# Altium schematic sheet mainBoard_SCH.SchDoc
size C
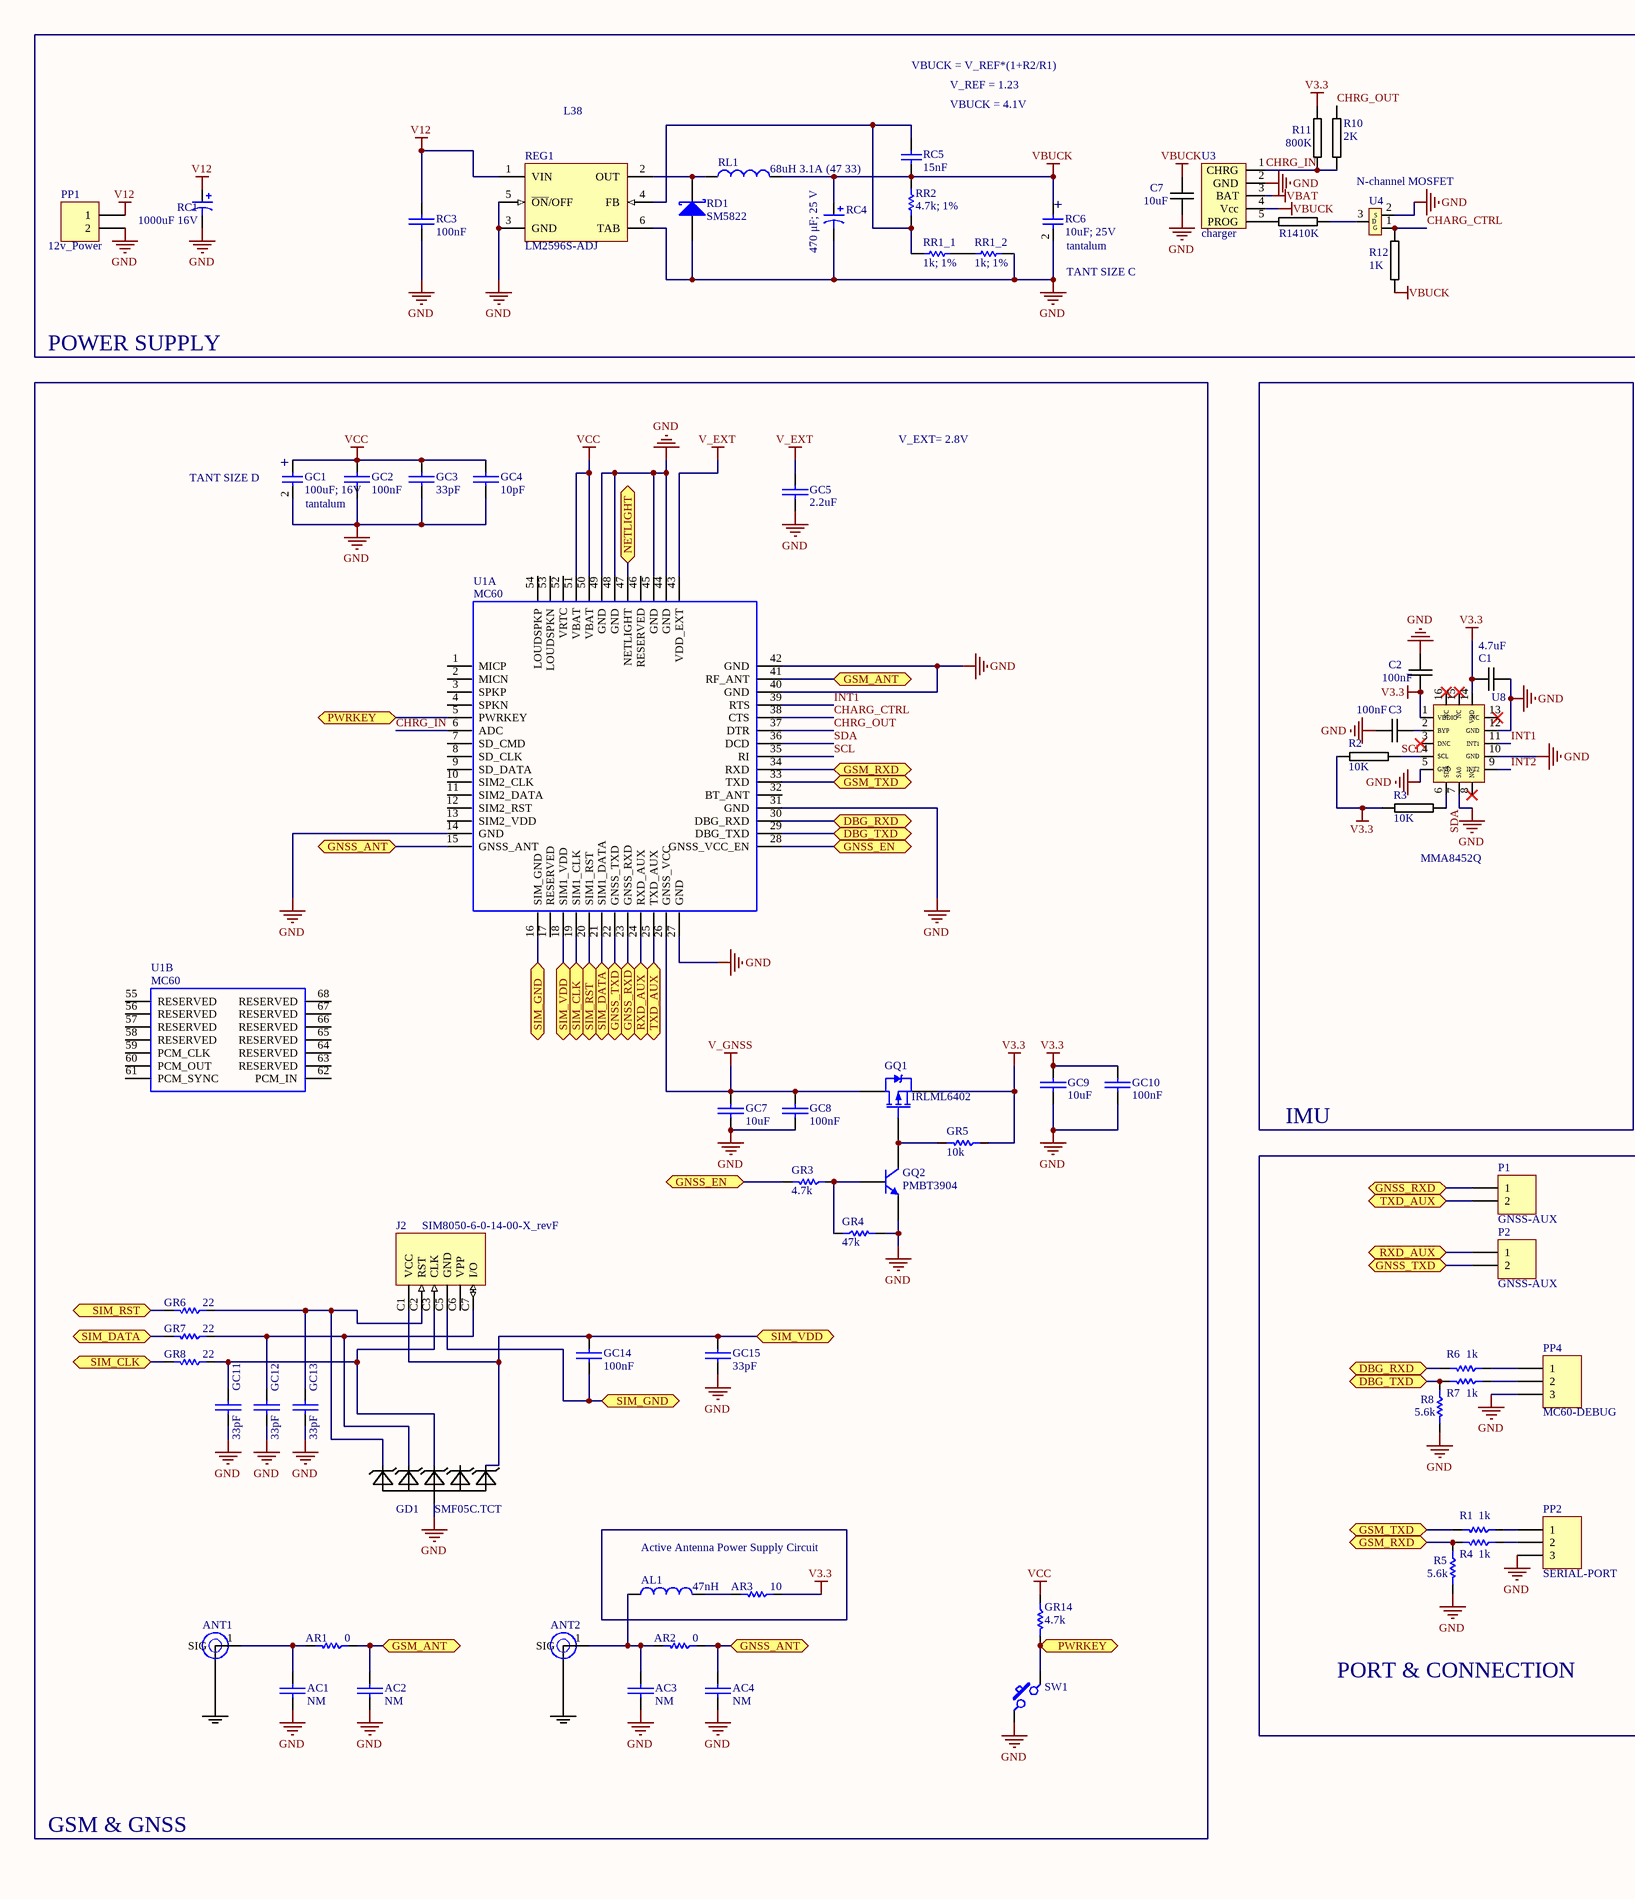
[diagram p0: mainBoard_SCH.SchDoc, left]
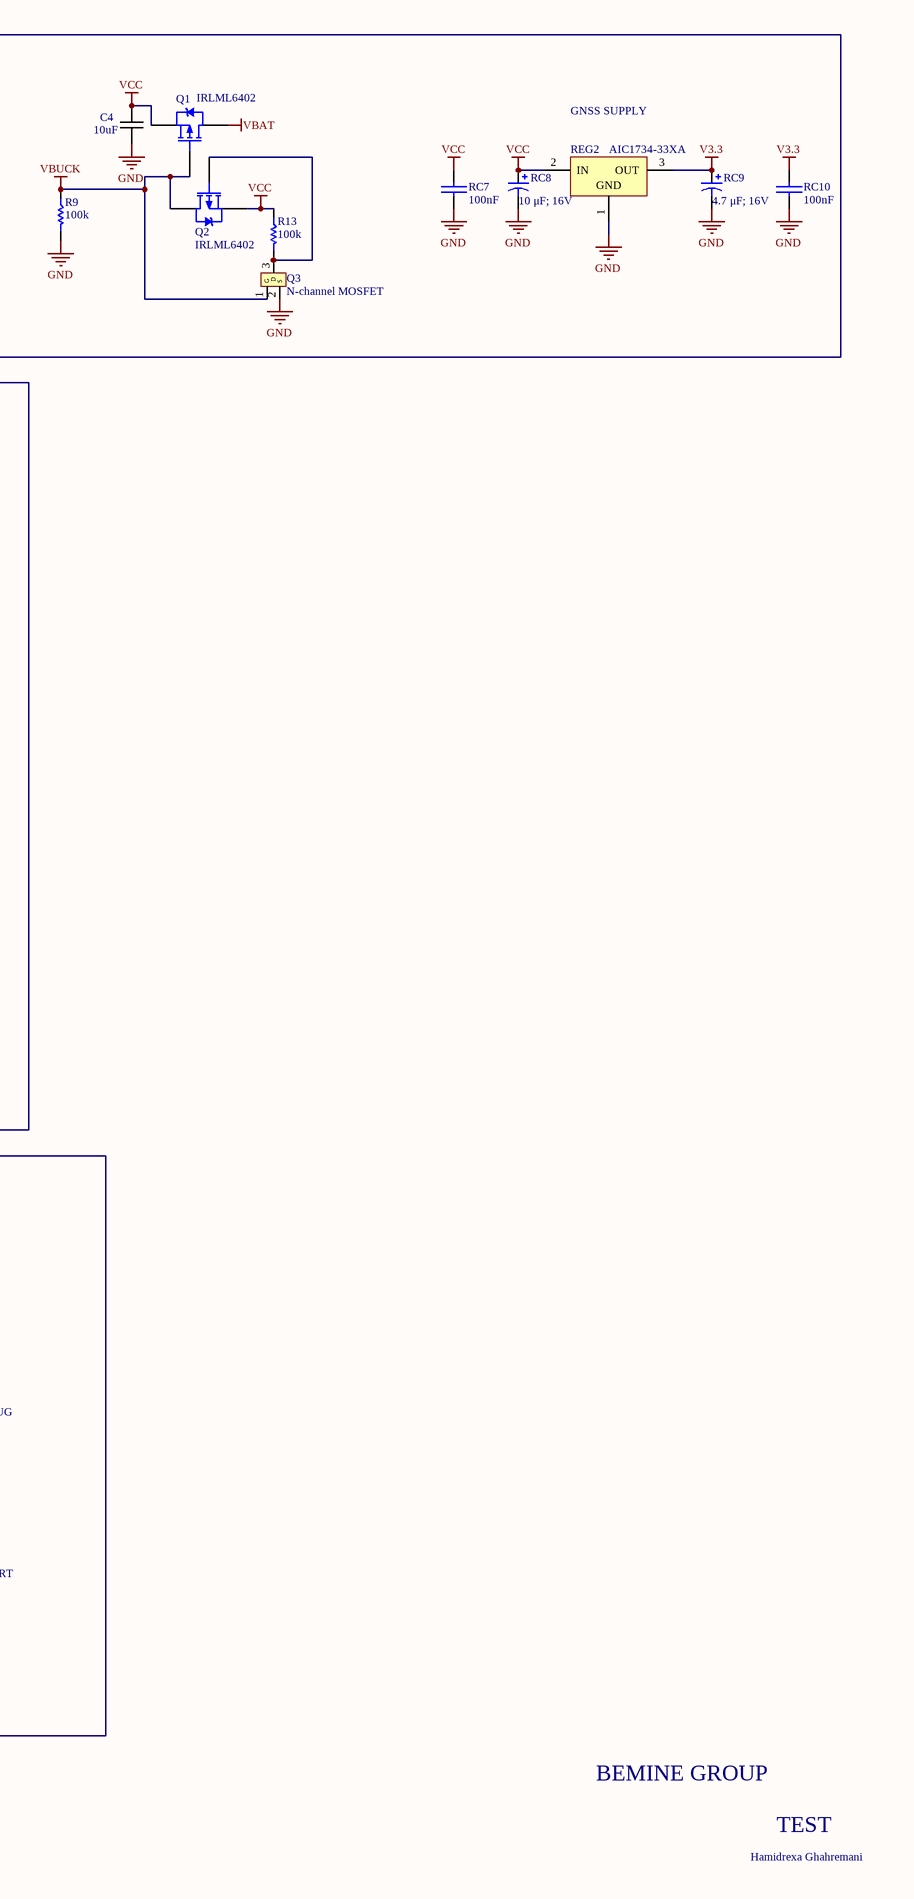
[diagram p1: mainBoard_SCH.SchDoc, right]

## Parts
AC1  NM  [0603R-1k]
AC2  NM  [0603R-1k]
AC3  NM  [0603R-1k]
AC4  NM  [0603R-1k]
AL1  47nH  [C1206]
ANT1  (no value)  [MOLEX_73412-0110]
ANT2  73412-0110  [MOLEX_73412-0110]  (value not drawn)
AR1  0  [0603R-1k]
AR2  0  [0603R-1k]
AR3  10  [C1206]
C1  4.7uF  [0603C-GENERIC]
C2  100nF  [0603C-GENERIC]
C3  100nF  [0603C-GENERIC]
C4  10uF  [0603C-GENERIC]
C7  10uF  [0603C-GENERIC]
GC1  100uF; 16V  TYPE: tantalum  [CAPCP7343X430N]
GC2  100nF  [0603R-1k]
GC3  33pF  [0603R-1k]
GC4  10pF  [0603R-1k]
GC5  2.2uF  [0603R-1k]
GC7  10uF  [0603R-1k]
GC8  100nF  [0603R-1k]
GC9  10uF  [0603R-1k]
GC10  100nF  [0603R-1k]
GC11  33pF  [0603R-1k]
GC12  33pF  [0603R-1k]
GC13  33pF  [0603R-1k]
GC14  100nF  [0603R-1k]
GC15  33pF  [0603R-1k]
GD1  SMF05C.TCT  [SC70-6]
GQ1  IRLML6402  [Micro3_N]
GQ2  PMBT3904  [SOT23_N]
GR3  4.7k  [0603R-1k]
GR4  47k  [0603R-1k]
GR5  10k  [0603R-1k]
GR6  22  [0603R-1k]
GR7  22  [0603R-1k]
GR8  22  [0603R-1k]
GR14  4.7k  [0603R-1k]
J2  SIM8050-6-0-14-00-X_revF  [SIM8050-6-0-14-00-X_revF]
P1  GNSS-AUX  [HDR1X2]
P2  GNSS-AUX  [HDR1X2]
PP1  12v_Power  [phoenix-2pin-200mil]
PP2  SERIAL-PORT  [HDR1X3]
PP4  MC60-DEBUG  [HDR1X3]
Q1  IRLML6402  [Micro3_N]
Q2  IRLML6402  [Micro3_N]
Q3  N-channel MOSFET  [SOT23]
R1  1k  [0603R-1k]
R2  10K  [0603R-1k]
R3  10K  [0603R-1k]
R4  1k  [0603R-1k]
R5  5.6k  [0603R-1k]
R6  1k  [0603R-1k]
R7  1k  [0603R-1k]
R8  5.6k  [0603R-1k]
R9  100k  [0603R-1k]
R10  2K  [0603R-1k]
R11  800K  [0603R-1k]
R12  1K  [0603R-1k]
R13  100k  [0603R-1k]
R14  10K  [0603R-1k]
RC1  1000uF 16V  [CAPR5-4X5]
RC3  100nF  [0603R-1k]
RC4  470 μF; 25 V  [CAPR5-4X5]
RC5  15nF  [0603R-1k]
RC6  10uF; 25V  TYPE: tantalum  [CAPCP6032X280N]
RC7  100nF  [0603R-1k]
RC8  10 μF; 16V  [CAPR5-4X5]
RC9  4.7 μF; 16V  [CAPR5-4X5]
RC10  100nF  [0603R-1k]
RD1  SM5822  [SMB]
REG1  LM2596S-ADJ  [TS5B_N]
REG2  AIC1734-33XA  [SOT89N]
RL1  68uH 3.1A (47 33)  [CAPR5-4X5]
RR1_1  1k; 1%  [C1206]
RR1_2  1k; 1%  [C1206]
RR2  4.7k; 1%  [C1206]
SW1  (no value)  [smd-switch]
U1  MC60  [XCVR_MC60]  (parts A,B of 2)
U3  charger  [SOT23-5]
U4  N-channel MOSFET  [SOT23]
U8  MMA8452Q  [MMA8452Q]

## Blocks framed on the sheet
POWER SUPPLY: C4 C7 PP1 Q1-Q3 R9-R14 RC1 RC3-RC10 RD1 REG1 REG2 RL1 RR1_1 RR1_2 RR2 U3 U4
GSM & GNSS: AC1-AC4 ANT1 ANT2 AR1 AR2 GC1-GC5 GC7-GC15 GD1 GQ1 GQ2 GR3-GR8 GR14 J2 SW1 U1
IMU: C1-C3 R2 R3 U8
PORT & CONNECTION: P1 P2 PP2 PP4 R1 R4-R8
Active Antenna Power Supply Circuit: AL1 AR3

## Ports
DBG_RXD (bidir), DBG_TXD (bidir), GNSS_ANT (bidir), GNSS_EN (bidir), GNSS_RXD (bidir), GNSS_TXD (bidir), GSM_ANT (bidir), GSM_RXD (bidir), GSM_TXD (bidir), NETLIGHT (bidir), PWRKEY (bidir), RXD_AUX (bidir), SIM_CLK (bidir), SIM_DATA (bidir), SIM_GND, SIM_RST (bidir), SIM_VDD, TXD_AUX (bidir)

## Nets
GND: AC1.2(-) AC2.2(-) AC3.2(-) AC4.2(-) ANT1.2(GND) ANT1.3(GND) ANT1.4(GND) ANT2.2(GND) ANT2.3(GND) ANT2.4(GND) C1.1 C2.1 C3.2 C4.2 C7.2 GC1.2 GC2.2(-) GC3.2(-) GC4.2(-) GC5.2(-) GC7.2(-) GC8.2(-) GC9.2(-) GC10.2(-) GC11.1(+) GC12.1(+) GC13.1(+) GC15.2(-) GD1.2(A) GQ2.2(E) GR4.2 PP1.2 PP2.3 PP4.3 Q3.2(S) R5.2 R8.2 R9.2 RC1.2 RC3.2(-) RC4.2 RC6.2 RC7.2(-) RC8.2 RC9.2 RC10.2(-) RD1.1(A) REG1.3(GND) REG1.5(~{ON}/OFF) REG1.6(TAB) REG2.1(GND) RR1_2.1 SW1.2 U1.14(GND) U1.27(GND) U1.31(GND) U1.40(GND) U1.42(GND) U1.44(GND) U1.45(GND) U1.48(GND) U1.49(GND) U3.2(GND) U4.2(S) U8.5(GND) U8.7(SA0) U8.10(GND) U8.12(GND)
V3.3: AR3.1 C1.2 C2.2 GC9.1(+) GC10.1(+) GQ1.2(S) GR5.1 R2.1 R3.1 R11.1 RC9.1 RC10.1(+) REG2.3(OUT) U8.1(VDDIO) U8.14(VDD)
V12: PP1.1 RC1.1 RC3.1(+) REG1.1(VIN)
V_EXT: GC5.1(+) U1.43(VDD_EXT)
V_GNSS: GC7.1(+) GC8.1(+) GQ1.3(D) U1.26(GNSS_VCC)
VBAT: Q1.3(D) U3.3(BAT)
VBUCK: C7.1 Q1.1(G) Q2.3(D) Q3.1(G) R9.1 R12.2 RC4.1 RC5.1 RC6.1 RL1.2 RR2.1 U3.4(Vcc)
VCC: C4.1 GC1.1 GC2.1(+) GC3.1(+) GC4.1(+) GR14.1 Q1.2(S) Q2.2(S) R13.1 RC7.1(+) RC8.1 REG2.2(IN) U1.50(VBAT) U1.51(VBAT)
CHARG_CTRL: R12.1 U1.38(CTS) U4.1(G)
CHRG_IN: R10.1 R11.2 U1.6(ADC) U3.1(CHRG)
CHRG_OUT: R10.2 U1.37(DTR)
DBG_RXD: R6.2 U1.30(DBG_RXD) ; port DBG_RXD
DBG_TXD: R7.2 R8.1 U1.29(DBG_TXD) ; port DBG_TXD
GNSS_ANT: AC4.1(+) AR2.1 U1.15(GNSS_ANT) ; port GNSS_ANT
GNSS_EN: GR3.2 U1.28(GNSS_VCC_EN) ; port GNSS_EN
GNSS_RXD: P1.1 U1.23(GNSS_RXD) ; port GNSS_RXD
GNSS_TXD: P2.2 U1.22(GNSS_TXD) ; port GNSS_TXD
GSM_ANT: AC2.1(+) AR1.1 U1.41(RF_ANT) ; port GSM_ANT
GSM_RXD: R4.2 R5.1 U1.34(RXD) ; port GSM_RXD
GSM_TXD: R1.2 U1.33(TXD) ; port GSM_TXD
INT1: U1.39(RTS) U8.11(INT1)
INT2: U8.9(INT2)
NETLIGHT: U1.47(NETLIGHT) ; port NETLIGHT
PWRKEY: GR14.2 SW1.1 U1.5(PWRKEY) ; port PWRKEY
RXD_AUX: P2.1 U1.24(RXD_AUX) ; port RXD_AUX
SCL: R2.2 U1.35(RI) U8.4(SCL)
SDA: R3.2 U1.36(DCD) U8.6(SDA)
SIM_CLK: GR8.2 U1.19(SIM1_CLK) ; port SIM_CLK
SIM_DATA: GR7.2 U1.21(SIM1_DATA) ; port SIM_DATA
SIM_GND: GC14.2(-) J2.C5(GND) U1.16(SIM_GND) ; port SIM_GND
SIM_RST: GR6.2 U1.20(SIM1_RST) ; port SIM_RST
SIM_VDD: GC14.1(+) GC15.1(+) GD1.6(C5) J2.C1(VCC) U1.18(SIM1_VDD) ; port SIM_VDD
TXD_AUX: P1.2 U1.25(TXD_AUX) ; port TXD_AUX
NetAC1_1: AC1.1(+) ANT1.1(SIG) AR1.2
NetAC3_1: AC3.1(+) AL1.1 ANT2.1(SIG) AR2.2
NetAL1_2: AL1.2 AR3.2
NetC3_1: C3.1 U8.2(BYP)
NetGC11_2: GC11.2(-) GD1.4(C3) GR8.1 J2.C3(CLK)
NetGC12_2: GC12.2(-) GD1.3(C2) GR7.1 J2.C7(I/O)
NetGC13_2: GC13.2(-) GD1.1(C1) GR6.1 J2.C2(RST)
NetGQ1_1: GQ1.1(G) GQ2.3(C) GR5.2
NetGQ2_1: GQ2.1(B) GR3.1 GR4.1
NetPP2_1: PP2.1 R1.1
NetPP2_2: PP2.2 R4.1
NetPP4_1: PP4.1 R6.1
NetPP4_2: PP4.2 R7.1
NetQ2_1: Q2.1(G) Q3.3(D) R13.2
NetR14_1: R14.1 U3.5(PROG)
NetR14_2: R14.2 U4.3(D)
NetRC5_2: RC5.2 REG1.4(FB) RR1_1.2 RR2.2
NetRD1_2: RD1.2(K) REG1.2(OUT) RL1.1
NetRR1_1_1: RR1_1.1 RR1_2.2

Not connected (* = marked no-connect by the designer): GD1 5(C4); J2 C6(VPP); U1 1(MICP) 2(MICN) 3(SPKP) 4(SPKN) 7(SD_CMD) 8(SD_CLK) 9(SD_DATA) 10(SIM2_CLK) 11(SIM2_DATA) 12(SIM2_RST) 13(SIM2_VDD) 17(RESERVED) 32(BT_ANT) 46(RESERVED) 52(VRTC) 53(LOUDSPKN) 54(LOUDSPKP) 55(RESERVED) 56(RESERVED) 57(RESERVED) 58(RESERVED) 59(PCM_CLK) 60(PCM_OUT) 61(PCM_SYNC) 62(PCM_IN) 63(RESERVED) 64(RESERVED) 65(RESERVED) 66(RESERVED) 67(RESERVED) 68(RESERVED); U8 3(DNC)* 8(NC)* 13(NC)* 15(NC)* 16(NC)*

## Notes on the sheet
- L38
- VBUCK = V_REF*(1+R2/R1)
- VBUCK = 4.1V
- V_REF = 1.23
- GNSS SUPPLY
- (near RC6) +
- (near RC6) TANT SIZE C
- V_EXT= 2.8V
- (near GC1) TANT SIZE D
- (near GC1) +
- BEMINE GROUP
- Hamidrexa Ghahremani
- TEST

## Library data of the parts
AC1-AC4 GC2-GC5 GC7-GC15 RC3 RC7 RC10 = Cap-Bipolar: Bipolar Capacitor; Voltage: 100V; Designer: Saeid Jorablo; Organazation: ControTec; Adding Date: 1387/12/20
  AC1-AC4: Value: NM
  GC2 GC8 GC10 GC14 RC3 RC7 RC10: Value: 100nF
  GC3 GC11-GC13 GC15: Value: 33pF
  GC4: Value: 10pF
  GC5: Value: 2.2uF
  GC7 GC9: Value: 10uF
AL1 RL1 = Inductor: Code_IEC: 1005; Value: 10mH; Published: 8-Jun-2000; LatestRevisionDate: 29-May-2009; LatestRevisionNote: IPC-7351 Footprint Added.; PackageReference: 0402-A; Publisher: Altium Limited; PackageDescription: Chip Inductor; Code_JEITA: 0402
ANT1 ANT2 = 73412-0110: 50 Ohms, Microcoaxial RF, PCB Vertical Jack Receptacle, SMT, 1.25mm Mounted Height; MF: Molex; MP: 73412-0110; Package: None; Price: 0.40 USD; Availability: Good; Value: *
AR1-AR3 GR3-GR8 GR14 R1 R4-R9 R13 = Resistor
  AR1 AR2: Value: 0
  AR3: Value: 10
  GR3 GR14: Value: 4.7k
  GR4: Value: 47k
  GR5: Value: 10k
  GR6-GR8: Value: 22
  R1 R4 R6 R7: Value: 1k
  R5 R8: Value: 5.6k
  R9 R13: Value: 100k
C1-C4 C7 = 0603C-1NF-50V-X7R-KEM: CAPACITOR 0603 CERAMIC; Reel: C45; Supplier 1: Digi-Key; Supplier Part Number 1: 399-1082-2-ND
GC1 RC5 RC6 = Cap: Capacitor; STATE: NOT-AVAILABLE; Published: 8-Jun-2000; LatestRevisionDate: 17-Jul-2002; LatestRevisionNote: Re-released for DXP Platform.; PackageReference: RAD-0.3; Publisher: Altium Limited; PackageDescription: Radial Cap, Thru-Hole; 2 Leads; 0.3 in Pin Spacing
  RC5: TYPE: tantalum
GD1 = SMF05C.TCT: MF: Semtech; Price: None; Package: SOT-363 Diodes Inc.; Availability: Unavailable; MP: SMF05C.TCT; Value: *
GQ1 Q1 Q2 = IRLML6401: HEXFET Power MOSFET; Published: 17-Sep-2003; DatasheetVersion: 2-Jul-2001; PackageVersion: Jul-2001; PackageReference: Micro3; Publisher: Altium Limited; PackageDescription: 3-Pin SOT-23 Package 0.95 mm Pitch, 2.3 mm Lead Span; ComponentLink1Description: Manufacturer Link; ComponentLink1URL: http://www.irf.com/; ComponentLink2Description: Datasheet; ComponentLink2URL: http://www.irf.com/product-info/datasheets/data/IRLML6401.pdf
GQ2 = PMBT3904: NPN Switching Transistor; Published: 17-Sep-2003; LatestRevisionDate: 12-Dec-2006; LatestRevisionNote: IPC-7351 Footprint Added.; DatasheetVersion: 27-Apr-1999; PackageVersion: May-1999; PackageReference: SOT23; Publisher: Altium Limited; PackageDescription: 3-Pin SOT-23 Package 0.95 mm Pitch, 2.3 mm Lead Span; ComponentLink1Description: Manufacturer Link; ComponentLink1URL: http://www.semiconductors.philips.com/; ComponentLink2Description: Datasheet; ComponentLink2URL: http://www.semiconductors.philips.com/acrobat/datasheets/PMBT3904_4.pdf
J2 = SIM8050-6-0-14-00-X_revF: Nano SIM Card Connector, Push-Pull Type, 6 Pin, SMT, Profile 1.35mm
P1 P2 PP1 = Header 2: Header, 2-Pin; LatestRevisionDate: 17-Jul-2002; LatestRevisionNote: Re-released for DXP Platform.; Publisher: Altium Limited
PP2 PP4 = Header 3: Header, 3-Pin; LatestRevisionDate: 17-Jul-2002; LatestRevisionNote: Re-released for DXP Platform.; Publisher: Altium Limited
Q3 U4 = 2N7002: NPN transistor
R2 R3 R10-R12 R14 = 0603R-1K: GENERIC RESISTOR 0603; Manufacturer Part Number: RMCF 1/16 1K 1% R; Manufacturer: Stackpole Electronics Inc; Reel: R14; Supplier 1: Digi-Key; Supplier Part Number 1: RMCF0603FT1K00TR-ND
RC1 = Cap Pol1: Polarized Capacitor (Radial); Value: 100pF; Published: 8-Jun-2000; LatestRevisionDate: 17-Jul-2002; LatestRevisionNote: Re-released for DXP Platform.; PackageReference: RB7.6-15; Publisher: Altium Limited; PackageDescription: Polarized Capacitor (Radial); 2 Leads
RC4 = WCAP-PSLC 10x12.4x4.5 875075361006: WCAP-PSLC Aluminum Polymer Capacitors , 680 μF; + / - 20%; 16 V , 10 x 12,4; Manufacturer: Wurth Elektronik; E-mail: libraries@we-online.com; Capacitance: 680 μF; Characteristics: Aluminum Polymer Capacitors; Recommended soldering: Reflow; Operating temperature: –55 °C to +105 °C; Large capacitance SMD product series; Very low ESR at high frequency range; High permissible ripple current; Long life and high reliability; Load life: 2000 h @ +105 °C; ComponentLink1Description: Manufacturer; ComponentLink1URL: http://www.we-online.com; ComponentLink2Description: Datasheet; ComponentLink2URL: http://katalog.we-online.de/pbs/datasheet/875075361006.pdf; Created by: Karrer Zheng; Created Date: 6/8/2015; Application: Low voltage port filtering, appplid to high-end switching power supply, PC(desktop,laptop ),industrial computer, VGA card, server power, charger, TV, digital set-top box,DC-DC power module, game machine etc which consume large current with high speed circuit.; partNo: 875075361006
RC8 = WCAP-PSLP 5x5.8x1.4 875105359001: WCAP-PSLP Aluminum Polymer Capacitors , 10 μF; + / - 20%; 16 V , 5 x 5,8; Manufacturer: Wurth Elektronik; E-mail: libraries@we-online.com; Capacitance: 10 μF; Characteristics: Aluminum Polymer Capacitors;Recommended soldering: Reflow;Operating temperature: –55 °C to +105 °C;Low profile SMD product series;Low ESR at high frequency range;High permissible ripple current;Load life: 2000 h @ +105 °C; ComponentLink1Description: Manufacturer; ComponentLink1URL: http://www.we-online.com; ComponentLink2Description: Datasheet; ComponentLink2URL: http://katalog.we-online.de/pbs/datasheet/875105359001.pdf; Created by: Karrer Zheng; Created Date: 5/13/2015; Application: Low voltage port filtering, appplid to high-end switching power supply, PC(desktop,laptop ),industrial computer, VGA card, server power, charger, TV, digital set-top box,DC-DC power module, game machine etc which consume large current with high speed circuit.; partNo: 875105359001
RC9 = WCAP-PSLP 5x5.8x1.4 875105359003: WCAP-PSLP Aluminum Polymer Capacitors , 22 μF; + / - 20%; 16 V , 5 x 5,8; Manufacturer: Wurth Elektronik; E-mail: libraries@we-online.com; Capacitance: 22 μF; Characteristics: Aluminum Polymer Capacitors;Recommended soldering: Reflow;Operating temperature: –55 °C to +105 °C;Low profile SMD product series;Low ESR at high frequency range;High permissible ripple current;Load life: 2000 h @ +105 °C; ComponentLink1Description: Manufacturer; ComponentLink1URL: http://www.we-online.com; ComponentLink2Description: Datasheet; ComponentLink2URL: http://katalog.we-online.de/pbs/datasheet/875105359003.pdf; Created by: Karrer Zheng; Created Date: 5/13/2015; Application: Low voltage port filtering, appplid to high-end switching power supply, PC(desktop,laptop ),industrial computer, VGA card, server power, charger, TV, digital set-top box,DC-DC power module, game machine etc which consume large current with high speed circuit.; partNo: 875105359003
RD1 = D Schottky: Schottky Diode; Published: 8-Jun-2000; LatestRevisionDate: 17-Jul-2002; LatestRevisionNote: Re-released for DXP Platform.; PackageReference: SMB; Publisher: Altium Limited; PackageDescription: DO-214-AA/SMB; 2 C-Bend Leads; Body 5.3 x 3.6 mm, inc. leads (LxW); Code_JEDEC: DO-214-AA
REG1 = LM2596S-ADJ: SIMPLE SWITCHER® Power Converter 150 KHz 3A Step-Down Voltage Regulator, 5-pin TO-263; Manufacturer: National Semiconductor; PackageTopMarking: NSUZXYTTE#*LM2596S*-ADJ P+; PowerWise: N; Published: 4-Dec-2008; DatasheetVersion: May-2002; PackageVersion: revD, Apr-2005; PackageReference: TS5B; Publisher: Altium Limited; PackageDescription: TO-263, Molded, .400 x .390 x .180in, 5 Lead, .067in Pitch, Surface Mount; Supplier 1: Farnell; Supplier Part Number 1: 1523864; Supplier 2: Farnell; Supplier Part Number 2: 9494367; PartNumber: LM2596S-ADJ; RoHS: N; PinCount: 5; CompType: Switcher; Code_JEDEC: MO-169-AB; ComponentLink1Description: LM2596 Datasheet; ComponentLink1URL: http://www.national.com/ds/LM/LM2596.pdf; ComponentLink2Description: LM2596 Web Page; ComponentLink2URL: http://www.national.com/pf/LM/LM2596.html; ComponentLink3Description: TS5B Package Page; ComponentLink3URL: http://www.national.com/packaging/folders/ts5b.html
REG2 = HT7530-1: 3.0V 100mA Low Power,  Low Dropout Voltage (LDO) Regulator; Published: 30-Mar-2007; DatasheetVersion: rev1.50, Jan-2006; PackageVersion: Jan-2006; PackageReference: SOT-89; Publisher: Altium Limited; PackageDescription: 3-Pin SOT-89 Package 1.5 mm Pitch, 4.1 mm Lead Span; Code_IPC: SOT89; ComponentLink1Description: Manufacturer Link; ComponentLink1URL: http://www.holtek.com/; ComponentLink2Description: Datasheet; ComponentLink2URL: http://www.holtek.com/pdf/consumer/75xx_1v150.pdf
RR1_1 RR1_2 RR2 = Res1: Resistor; Published: 8-Jun-2000; LatestRevisionDate: 17-Jul-2002; LatestRevisionNote: Re-released for DXP Platform.; PackageReference: AXIAL-0.3; Publisher: Altium Limited; PackageDescription: Axial Device, Thru-Hole; 2 Leads; 0.3 in Pin Spacing
  RR1_1 RR1_2: Value: 1k; 1%
  RR2: Value: 4.7k; 1%
SW1 = SW-PB-A-BLACK-SMD: PUSHBUTTON SWITCH 6MM SMD
U3 = LTC4054-4.2: Li-Ion Battery Charger
U1 = MC60: PCB DECAL: *